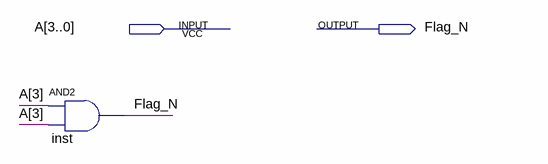
[diagram p0: schematic sheet]
// Quartus schematic Flag_N.bdf as structural Verilog: 1 symbols, 2 pins
module Flag_N (
  input  [3:0] A,
  output Flag_N
);

  and inst (Flag_N, A[3], A[3]);
endmodule
